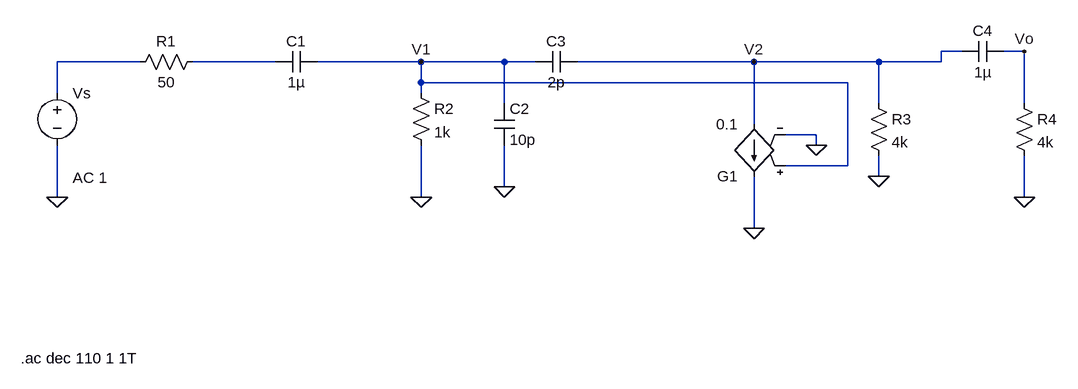
[diagram p0: schematic Figure 1.3 MP1.asc]
Figure 1.3 MP1.asc, the LTspice schematic file:
Version 4
SHEET 1 1600 680
WIRE 1424 80 1392 80
WIRE 1520 80 1488 80
WIRE 160 96 32 96
WIRE 368 96 240 96
WIRE 592 96 432 96
WIRE 720 96 592 96
WIRE 768 96 720 96
WIRE 1104 96 832 96
WIRE 1296 96 1104 96
WIRE 1392 96 1392 80
WIRE 1392 96 1296 96
WIRE 592 128 592 96
WIRE 1248 128 592 128
WIRE 32 144 32 96
WIRE 592 144 592 128
WIRE 720 160 720 96
WIRE 1296 160 1296 96
WIRE 1520 160 1520 80
WIRE 1104 192 1104 96
WIRE 1200 208 1152 208
WIRE 1200 224 1200 208
WIRE 1248 256 1248 128
WIRE 1248 256 1152 256
WIRE 1296 272 1296 240
WIRE 720 288 720 224
WIRE 32 304 32 224
WIRE 592 304 592 224
WIRE 1520 304 1520 240
WIRE 1104 352 1104 272
FLAG 592 304 0
FLAG 1104 352 0
FLAG 1296 272 0
FLAG 1520 304 0
FLAG 1200 224 0
FLAG 32 304 0
FLAG 592 96 V1
FLAG 1104 96 V2
FLAG 1520 80 Vo
FLAG 720 288 0
SYMBOL voltage 32 128 R0
WINDOW 123 24 146 Left 2
WINDOW 39 0 0 Left 0
SYMATTR Value2 AC 1
SYMATTR InstName Vs
SYMATTR Value ""
SYMBOL res 256 80 R90
WINDOW 0 0 56 VBottom 2
WINDOW 3 32 56 VTop 2
SYMATTR InstName R1
SYMATTR Value 50
SYMBOL res 576 128 R0
SYMATTR InstName R2
SYMATTR Value 1k
SYMBOL g 1104 288 R180
SYMATTR InstName G1
SYMATTR Value 0.1
SYMBOL res 1280 144 R0
SYMATTR InstName R3
SYMATTR Value 4k
SYMBOL res 1504 144 R0
SYMATTR InstName R4
SYMATTR Value 4k
SYMBOL cap 432 80 R90
WINDOW 0 0 32 VBottom 2
WINDOW 3 32 32 VTop 2
SYMATTR InstName C1
SYMATTR Value 1µ
SYMBOL cap 1488 64 R90
WINDOW 0 0 32 VBottom 2
WINDOW 3 32 32 VTop 2
SYMATTR InstName C4
SYMATTR Value 1µ
SYMBOL cap 704 160 R0
SYMATTR InstName C2
SYMATTR Value 10p
SYMBOL cap 832 80 R90
WINDOW 0 0 32 VBottom 2
WINDOW 3 32 32 VTop 2
SYMATTR InstName C3
SYMATTR Value 2p
TEXT -24 552 Left 2 !.ac dec 110 1 1T

The netlist it stands for:
* Figure 1.3 MP1.asc
Vs N001 0 AC 1
R1 N002 N001 50
R2 V1 0 1k
G1 V2 0 V1 0 0.1
R3 V2 0 4k
R4 Vo 0 4k
C1 V1 N002 1µ
C4 Vo V2 1µ
C2 V1 0 10p
C3 V2 V1 2p
.ac dec 110 1 1T
.backanno
.end

* Results of the author's LTspice run, read from the files saved beside the schematic
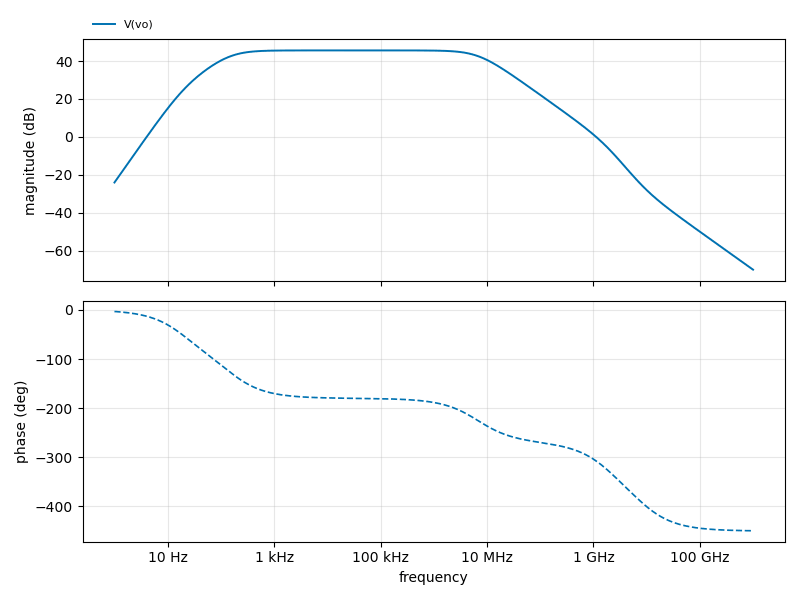
[diagram p1: AC Analysis of Figure 1.3 MP1.asc, plotted from the saved traces]
* AC Analysis, 1 run:
*   V(vo): -24.00 dB at 1 Hz, -69.94 dB at 1 THz, peak 45.59 dB at 32.29 kHz, 3 dB below the peak at 154.1 Hz and 6.764 MHz